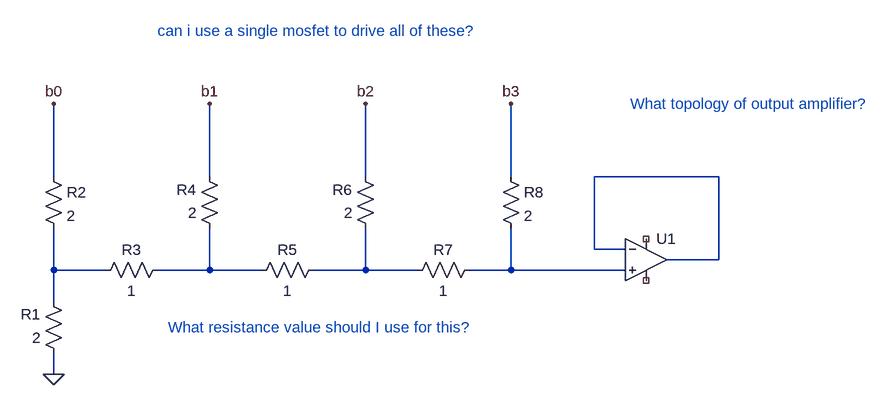
[diagram p0: schematic R2R_DAC.asc]
R2R_DAC.asc, the LTspice schematic file:
Version 4.1
SHEET 1 1220 680
WIRE -80 -32 -80 -144
WIRE 160 -32 160 -144
WIRE 400 -32 400 -144
WIRE 624 -32 624 -144
WIRE 944 -32 752 -32
WIRE 752 80 752 -32
WIRE 800 80 752 80
WIRE 944 96 944 -32
WIRE 944 96 864 96
WIRE -80 112 -80 48
WIRE 0 112 -80 112
WIRE 160 112 160 48
WIRE 160 112 80 112
WIRE 240 112 160 112
WIRE 400 112 400 48
WIRE 400 112 320 112
WIRE 480 112 400 112
WIRE 624 112 624 48
WIRE 624 112 560 112
WIRE 800 112 624 112
WIRE -80 160 -80 112
WIRE -80 272 -80 240
FLAG -80 272 0
FLAG -80 -144 b0
FLAG 160 -144 b1
FLAG 400 -144 b2
FLAG 624 -144 b3
SYMBOL res -64 256 R180
WINDOW 0 36 76 Left 2
WINDOW 3 36 40 Left 2
SYMATTR InstName R1
SYMATTR Value 2
SYMBOL res -96 -48 R0
SYMATTR InstName R2
SYMATTR Value 2
SYMBOL res 96 96 R90
WINDOW 0 0 56 VBottom 2
WINDOW 3 32 56 VTop 2
SYMATTR InstName R3
SYMATTR Value 1
SYMBOL res 176 64 R180
WINDOW 0 36 76 Left 2
WINDOW 3 36 40 Left 2
SYMATTR InstName R4
SYMATTR Value 2
SYMBOL res 224 128 R270
WINDOW 0 32 56 VTop 2
WINDOW 3 0 56 VBottom 2
SYMATTR InstName R5
SYMATTR Value 1
SYMBOL res 416 64 R180
WINDOW 0 36 76 Left 2
WINDOW 3 36 40 Left 2
SYMATTR InstName R6
SYMATTR Value 2
SYMBOL res 464 128 R270
WINDOW 0 32 56 VTop 2
WINDOW 3 0 56 VBottom 2
SYMATTR InstName R7
SYMATTR Value 1
SYMBOL res 608 -48 R0
SYMATTR InstName R8
SYMATTR Value 2
SYMBOL OpAmps\\UniversalOpAmp 832 96 R0
SYMATTR InstName U1
TEXT 80 -256 Left 2 ;can i use a single mosfet to drive all of these?
TEXT 96 200 Left 2 ;What resistance value should I use for this?
TEXT 808 -144 Left 2 ;What topology of output amplifier?

The netlist it stands for:
* R2R_DAC.asc
R1 0 N002 2
R2 b0 N002 2
R3 N003 N002 1
R4 N003 b1 2
R5 N003 N004 1
R6 N004 b2 2
R7 N004 N005 1
R8 b3 N005 2
X§U1 N005 N001 NC_01 NC_02 N001 level1 Avol=1Meg GBW=10Meg Vos=0 En=0 Enk=0 In=0 Ink=0 Rin=500Meg  ; pins In+ In- V+ V- OUT
* can i use a single mosfet to drive all of these?
* What resistance value should I use for this?
* What topology of output amplifier?
.lib UniversalOpAmp1.lib
.backanno
.end